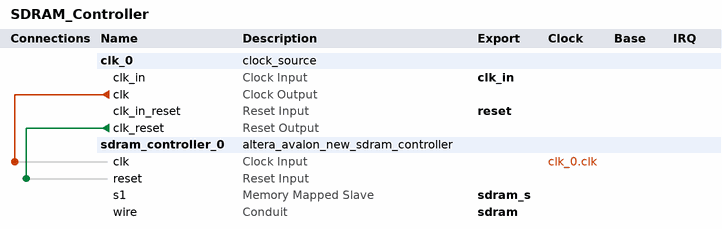
[diagram p0: system contents]
# Platform Designer (Qsys) system SDRAM_Controller, Cyclone V 5CEBA2U15C8
# Parameters at their usual value, and those the tool derives, are not listed.
package require -exact qsys 18.1
create_system SDRAM_Controller
set_project_property DEVICE_FAMILY {Cyclone V}
set_project_property DEVICE 5CEBA2U15C8

add_instance clk_0 clock_source 18.1
set_instance_parameter_value clk_0 clockFrequency 150000000

add_instance sdram_controller_0 altera_avalon_new_sdram_controller 18.1
set_instance_parameter_value sdram_controller_0 TAC 6.0
set_instance_parameter_value sdram_controller_0 TRCD 15.0
set_instance_parameter_value sdram_controller_0 TRFC 72.0
set_instance_parameter_value sdram_controller_0 TRP 15.0
set_instance_parameter_value sdram_controller_0 casLatency 2
set_instance_parameter_value sdram_controller_0 columnWidth 8
set_instance_parameter_value sdram_controller_0 dataWidth 16
set_instance_parameter_value sdram_controller_0 generateSimulationModel false
set_instance_parameter_value sdram_controller_0 model single_Micron_MT48LC4M32B2_7_chip
set_instance_parameter_value sdram_controller_0 numberOfBanks 4
set_instance_parameter_value sdram_controller_0 numberOfChipSelects 1
set_instance_parameter_value sdram_controller_0 powerUpDelay 200.0
set_instance_parameter_value sdram_controller_0 refreshPeriod 15.625
set_instance_parameter_value sdram_controller_0 rowWidth 12

# connections
add_connection clk_0.clk sdram_controller_0.clk clock
add_connection clk_0.clk_reset sdram_controller_0.reset reset

# exported interfaces
add_interface clk_in clock sink
set_interface_property clk_in EXPORT_OF clk_0.clk_in
add_interface reset reset sink
set_interface_property reset EXPORT_OF clk_0.clk_in_reset
add_interface sdram conduit end
set_interface_property sdram EXPORT_OF sdram_controller_0.wire
add_interface sdram_s avalon slave
set_interface_property sdram_s EXPORT_OF sdram_controller_0.s1

set_interconnect_requirement {$system} qsys_mm.clockCrossingAdapter HANDSHAKE
set_interconnect_requirement {$system} qsys_mm.enableEccProtection FALSE
set_interconnect_requirement {$system} qsys_mm.insertDefaultSlave FALSE
set_interconnect_requirement {$system} qsys_mm.maxAdditionalLatency 1

save_system SDRAM_Controller.qsys
